# Altium schematic sheet Driver Display - Voltage Regulator.SchDoc
size Letter; Organization: Midnight Sun Solar Rayce Car Team; Address1: University of Waterloo; Address2: 200 University Ave W; Address3: Waterloo, ON, Canada; Address4: N2L 3E9; Website: www.uwmidsun.com
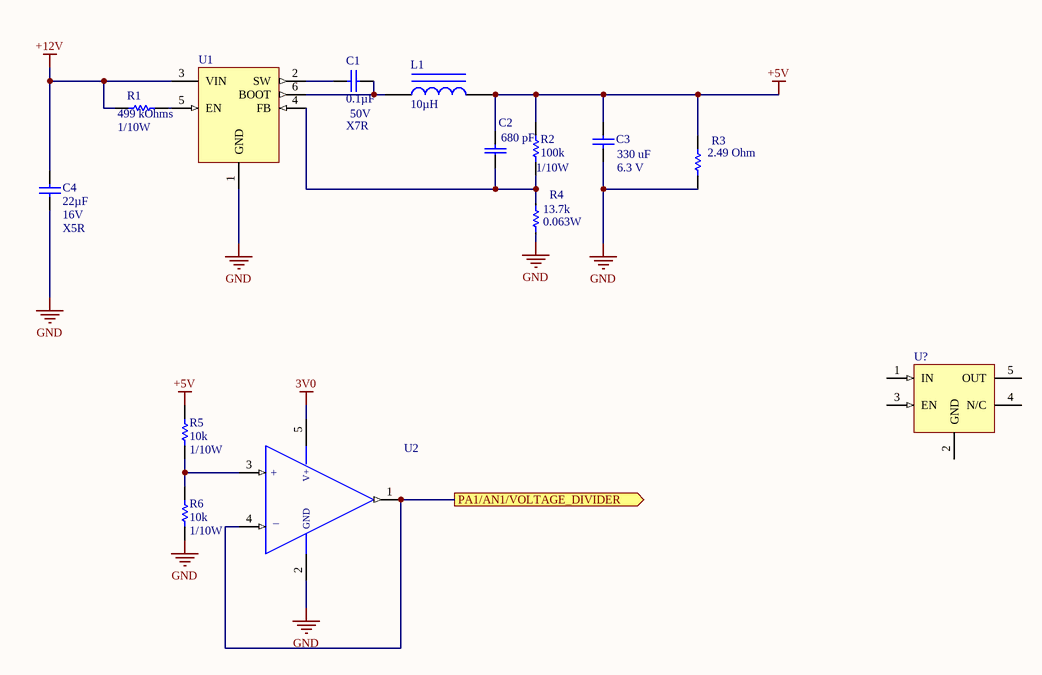
[diagram p0: Driver Display - Voltage Regulator.SchDoc]

## Parts
C1  Capacitance: 0.1µF  Voltage: 50V  Temperature Coefficient: X7R  [CAP, 0603]  (hidden comment: CAP CER 0.1UF 50V 10% X7R 0603)
C2  CAP CER 680PF 25V C0G 0201  [CAP, 0603]  (value not drawn)
C3  CAP CER 330UF 6.3V X5R 1210  (value not drawn)
C4  Capacitance: 22µF  Voltage: 16V  Temperature Coefficient: X5R  [CAP, 1210]  (hidden comment: CAP CER 22UF 16V ±20% X5R 1210)
L1  Inductance: 10µH  [1210]  (hidden comment: IND 10uH 0.9A 20% 1210)
R1  RES 499K OHM 1% 1/10W 0603  [RES, 0603]  (value not drawn)
R2  Resistance: 100k  Power: 1/10W  [RES, 0603]  (hidden comment: RES 100K OHM 5% 1/8W 0603_1)
R3  RES 2.49 OHM 1% 1/10W 0603  [RES, 0603]  (value not drawn)
R4  RES 13.7K OHM 1% 1/10W 0603  [RES, 0603]  (value not drawn)
R5  Resistance: 10k  Power: 1/10W  [RES, 0603]  (hidden comment: RES 10K OHM 1% 1/10W 0603)
R6  Resistance: 10k  Power: 1/10W  [RES, 0603]  (hidden comment: RES 10K OHM 1% 1/10W 0603)
U1  IC REG BUCK ADJ 2A SYNC 6SOT  [SOT23-6]  (value not drawn)
U2  IC OP AMP GEN PURPOSE RR 10MHZ SOT-23-5  [IC OP AMP GP RR 10MHZ SOT-23-5]  (value not drawn)
U?  IC REG LDO 3V 250MA SOT23-5  [SOT95P280X145-5N]  (value not drawn)

## Ports
PA1/AN1/VOLTAGE_DIVIDER (out)

## Nets
3V0: U2.5(VDD)
+5V: C2.1 C3.1 L1.2 R2.1 R3.1 R5.1
+12V: C4.1 R1.1 U1.3(VIN)
GND: C3.2 C4.2 R3.2 R4.?2 R6.2 U1.1(GND) U2.2(VSS)
PA1/AN1/VOLTAGE_DIVIDER: U2.1(OUTPUT) U2.4(-IN) ; port PA1/AN1/VOLTAGE_DIVIDER
NetC1_1: C1.1 U1.2(SW)
NetC1_2: C1.2 L1.1 U1.6(BOOT)
NetC2_2: C2.2 R2.2 R4.?1 U1.4(FB)
NetR1_2: R1.2 U1.5(EN)
NetR5_2: R5.2 R6.1 U2.3(+IN)

Not connected (* = marked no-connect by the designer): U? 1(IN) 2(GND) 3(EN) 4(N/C) 5(OUT)

## Notes on the sheet
- (near R1) 499 kOhms
- (near R1) 1/10W
- (near C3) 330 uF
- (near C3) 6.3 V
- Project:
- Title:
- Size:
- Project Lead:
- Letter
- Revision:
- University of Waterloo
- 200 University Ave W
- Waterloo, ON, Canada
- N2L 3E9
- Date:
- Sheet
- of
- Website:
- (in symbol CAP CER 680PF 25V C0G 0201) 680 pF
- (in symbol IC OP AMP GEN PURPOSE RR 10MHZ SOT-23-5) V+; +; GND; _
- (in symbol RES 2.49 OHM 1% 1/10W 0603) 2.49 Ohm
- (in symbol RES 13.7K OHM 1% 1/10W 0603) 13.7k; 0.063W

## Library data of the parts
C1 = CAP CER 0.1UF 50V 10% X7R 0603: 0.10µF ±10% 50V Ceramic Capacitor X7R 0603 (1608 Metric); Manufacturer 1: AVX Corporation; Manufacturer Part Number 1: 06035C104KAT2A; Supplier 1: Digi-Key; Supplier Part Number 1: 478-5052-1-ND; Packaging: Cut Tape (CT); Part Status: Active; Operating Temperature: -55°C ~ 125°C; Ratings: -; Mounting Type: Surface Mount, MLCC; Package / Case: 0603 (1608 Metric); Size / Dimension: 0.063" L x 0.032" W (1.60mm x 0.81mm); Height - Seated (Max): -; Thickness (Max): 0.035" (0.90mm); Lead Spacing: -; Lead Style: -; ComponentLink1URL: http://datasheets.avx.com/X7RDielectric.pdf; ComponentLink1Description: http://datasheets.avx.com/X7RDielectric.pdf; Tolerance: ±10%
C2 = CAP CER 680PF 25V C0G 0201: 680pF ±5% 25V Ceramic Capacitor C0G, NP0 0201 (0603 Metric); Manufacturer: Murata; Manufacturer Part Number: GRM0335C1E681JA01D; Supplier 1: Digi-Key; Stock 1: 66100; Pricing 1: 1=0.1, 10=0.017, 100=0.0078, 500=0.0056, 1000=0.0044, 2500=0.004, 5000=0.0037 (USD); Voltage Rating (DC): 25V; Dielectric: C0G; Tolerance: 5%; Capacitance: 680pF; Length: 600um; Width: 300um; Thickness: 300um; Supplier Part Number 1: 490-14330-1-ND
C3 = CAP CER 330UF 6.3V X5R 1210: 330µF ±20% 6.3V Ceramic Capacitor X5R 1210 (3225 Metric); Manufacturer: Taiyo Yuden; Manufacturer Part Number: JMK325ABJ337MM-P; Supplier 1: Digi-Key; Stock 1: 1427; Pricing 1: 1=5.57, 10=4.492, 100=3.5039, 500=2.6055 (USD); Supplier Part Number 1: 587-5449-1-ND
C4 = CAP CER 22UF 16V ±20% X5R 1210: 22µF ±20% 16V Ceramic Capacitor X5R 1210 (3225 Metric); Manufacturer 1: Murata Electronics North America; Manufacturer Part Number 1: GRM32ER61C226ME20L; Supplier 1: Digi-Key; Supplier Part Number 1: 490-1881-1-ND; Packaging: Cut Tape (CT); Part Status: Active; Operating Temperature: -55°C ~ 85°C; Ratings: -; Mounting Type: Surface Mount, MLCC; Package / Case: 1210 (3225 Metric); Size / Dimension: 0.126" L x 0.098" W (3.20mm x 2.50mm); Height - Seated (Max): -; Thickness (Max): 0.106" (2.70mm); Lead Spacing: -; Lead Style: -; ComponentLink1URL: http://www.murata.com/~/media/webrenewal/support/library/catalog/products/capacitor/mlcc/c02e.ashx; ComponentLink1Description: http://www.murata.com/~/media/webrenewal/support/library/catalog/products/capacitor/mlcc/c02e.ashx; Tolerance: ±20%
L1 = IND 10uH 0.9A 20% 1210: 10µH Shielded Wirewound Inductor 900mA 420 mOhm Max 1210 (3225 Metric); Manufacturer: Murata Electronics North America; Manufacturer Part Number: 1277AS-H-100M=P2; Current - Saturation: 1.25A; Supplier 1: Digi-Key; Supplier Part Number 1: 490-10589-1-ND; Type: Wirewound; Tolerance: ±20%; Current Rating: 0.9A; Shielding: Shielded; DC Resistance (DCR): 420 mOhm Max; Height - Seated (Max): 0.047" (1.20mm); ComponentLink1URL: http://www.toko.co.jp/products-murata/pdf/inductors/m_dfe322512c.pdf; ComponentLink1Description: datasheet
R1 = RES 499K OHM 1% 1/10W 0603: 499 kOhms ±1% 0.1W, 1/10W Chip Resistor 0603 (1608 Metric) Automotive AEC-Q200 Thick Film; Manufacturer: Stackpole Electronics; Manufacturer Part Number: RMCF0603FT499K; Resistance: 499kR; Power Rating: 100mW; Temperature Coefficient: 100ppm/°C; Supplier 1: Digi-Key; Stock 1: 5000; Mount: Surface Mount; Case/Package: 0603; Case Code (Metric): 1608; Case Code (Imperial): 0603; Contact Plating: Tin,Matte; Min Operating Temperature: -55°C; Max Operating Temperature: 155°C; Tolerance: 1%; Packaging: Tape and Reel; Composition: Thick Film; Number of Terminations: 2; Max Power Dissipation: 100mW; Length: 0.061inch; Height: 0.022inch; Width: 0.031inch; Radiation Hardening: No; Lead Free: Lead Free; ComponentLink1URL: https://www.seielect.com/Catalog/SEI-RMCF_RMCP.pdf; ComponentLink1Description: https://www.seielect.com/Catalog/SEI-RMCF_RMCP.pdf; ComponentLink2URL: http://components.arrow.com/part/dataview/40961429S7516275N1174; ComponentLink2Description: http://components.arrow.com/part/dataview/40961429S7516275N1174; ComponentLink3URL: http://www.seielect.com/Catalog/SEI-RMCF_RMCP.pdf; ComponentLink3Description: http://www.seielect.com/Catalog/SEI-RMCF_RMCP.pdf; Supplier Part Number 1: RMCF0603FT499K-ND
R2 = RES 100K OHM 5% 1/8W 0603_1: RES SMD 100K OHM 5% 1/10W 0603; Manufacturer 1: Yageo; Manufacturer Part Number 1: RC0603JR-07100KL; Temperature Coefficient: ±100ppm/°C; Supplier 1: Digi-Key; Supplier Part Number 1: 311-100KGRCT-ND; Packaging: Cut Tape (CT); Part Status: Active; Composition: Thick Film; Operating Temperature: -55°C ~ 155°C; Package / Case: 0603 (1608 Metric); Supplier Device Package: 0603; Size / Dimension: 0.063" L x 0.031" W (1.60mm x 0.80mm); Height - Seated (Max): 0.022" (0.55mm); Failure Rate: -; ComponentLink1URL: http://www.yageo.com/documents/recent/PYu-RC_Group_51_RoHS_L_7.pdf; ComponentLink1Description: http://www.yageo.com/documents/recent/PYu-RC_Group_51_RoHS_L_7.pdf; Tolerance: ±5%
R3 = RES 2.49 OHM 1% 1/10W 0603: 2.49 Ohms ±1% 0.1W, 1/10W Chip Resistor 0603 (1608 Metric) Moisture Resistant Thick Film; Manufacturer: Yageo; Manufacturer Part Number: RC0603FR-072R49L; Resistance: 2.49R; Temperature Coefficient: 200ppm/°C; Power Rating: 100mW; Voltage Rating: 50V; Working Voltage: 75V; Supplier 1: Digi-Key; Stock 1: 24600; Pricing 1: 1=0.1, 10=0.022, 100=0.0089, 1000=0.004, 2500=0.0035 (USD); Case/Package: 0603; Case Code (Metric): 1608; Case Code (Imperial): 0603; Contact Plating: Tin,Matte; Min Operating Temperature: -55°C; Max Operating Temperature: 155°C; Tolerance: 1%; Package Quantity: 1; Packaging: Tape and Reel; Composition: Thick Film; Number of Terminations: 2; Max Power Dissipation: 100mW; Termination: SMD/SMT; Voltage Rating (DC): 50V; Length: 0.063inch; Height: 0.022inch; Width: 0.031inch; Radiation Hardening: No; Lead Free: Lead Free; ComponentLink1URL: https://datasheet.ciiva.com/2456/pyu-r-int-thick-7-2456963.pdf; ComponentLink1Description: https://datasheet.ciiva.com/2456/pyu-r-int-thick-7-2456963.pdf; ComponentLink2URL: https://datasheet.ciiva.com/2456/pyu-r-int-thick-7-2456964.pdf; ComponentLink2Description: https://datasheet.ciiva.com/2456/pyu-r-int-thick-7-2456964.pdf; ComponentLink3URL: https://datasheet.ciiva.com/2456/pyu-r-int-thick-7-2456965.pdf; ComponentLink3Description: https://datasheet.ciiva.com/2456/pyu-r-int-thick-7-2456965.pdf; ComponentLink4URL: https://datasheet.ciiva.com/12575/rc0603-272842-12575883.pdf; ComponentLink4Description: https://datasheet.ciiva.com/12575/rc0603-272842-12575883.pdf; Supplier Part Number 1: 311-2.49HRCT-ND
R4 = RES 13.7K OHM 1% 1/10W 0603: 13.7 kOhms ±1% 0.1W, 1/10W Chip Resistor 0603 (1608 Metric) Automotive AEC-Q200 Thick Film; Supplier 1: Digi-Key
R5 R6 = RES 10K OHM 1% 1/10W 0603: RES SMD 10K OHM 1% 1/10W 0603; Manufacturer 1: Yageo; Manufacturer Part Number 1: RC0603FR-0710KL; Temperature Coefficient: ±100ppm/°C; Supplier 1: Digi-Key; Supplier Part Number 1: 311-10.0KHRCT-ND; Packaging: Cut Tape (CT); Part Status: Active; Composition: Thick Film; Operating Temperature: -55°C ~ 155°C; Package / Case: 0603 (1608 Metric); Supplier Device Package: 0603; Size / Dimension: 0.063" L x 0.031" W (1.60mm x 0.80mm); Height - Seated (Max): 0.022" (0.55mm); Failure Rate: -; ComponentLink1URL: http://www.yageo.com/documents/recent/PYu-RC_Group_51_RoHS_L_7.pdf; ComponentLink1Description: http://www.yageo.com/documents/recent/PYu-RC_Group_51_RoHS_L_7.pdf; Tolerance: ±1%
U1 = IC REG BUCK ADJ 2A SYNC 6SOT: Buck Switching Regulator IC Positive Adjustable 0.596V 1 Output 2A SOT-23-6 Thin, TSOT-23-6; Manufacturer: Texas Instruments; Manufacturer Part Number: TPS54202HDDCT; Min Input Voltage: 4.5V; Max Input Voltage: 28V; Number of Outputs: 1; Min Output Voltage: 600mV; Max Output Voltage: 26V; Switching Frequency: 500kHz; Quiescent Current: 40uA; Supplier 1: Digi-Key; Stock 1: 2574; Pricing 1: 1=2, 10=1.796, 100=1.4436 (USD); Case/Package: SOT-6; Number of Pins: 6; Min Operating Temperature: -40°C; Max Operating Temperature: 125°C; Output Current: 2A; Packaging: Cut Tape; Output Voltage: 26V; REACH SVHC: No SVHC; Lead Free: Lead Free; ComponentLink1URL: http://www.ti.com/lit/ds/symlink/tps54202h.pdf; ComponentLink1Description: http://www.ti.com/lit/ds/symlink/tps54202h.pdf; ComponentLink2URL: http://www.ti.com/general/docs/lit/getliterature.tsp?genericPartNumber=TPS54202H&amp;&amp;fileType=pdf; ComponentLink2Description: http://www.ti.com/general/docs/lit/getliterature.tsp?genericPartNumber=TPS54202H&amp;&amp;fileType=pdf; ComponentLink3URL: http://www.ti.com/general/docs/lit/getliterature.tsp?genericPartNumber=TPS54202H&&fileType=pdf; ComponentLink3Description: http://www.ti.com/general/docs/lit/getliterature.tsp?genericPartNumber=TPS54202H&&fileType=pdf; Supplier Part Number 1: 296-44497-1-ND
U2 = IC OP AMP GEN PURPOSE RR 10MHZ SOT-23-5: General Purpose Amplifier 1 Circuit Rail-to-Rail SOT-23-5; Manufacturer 1: Texas Instruments; Manufacturer Part Number 1: TLV316QDBVRQ1; Description 1: IC OP AMP GP RR 10MHZ 5-SOT-23; Number of Circuits: 1; Slew Rate: 6 V/µs; Current - Supply: 400µA; Current - Output / Channel: 50mA; Voltage - Supply, Single/Dual (±): 1.8 V ~ 5.5 V, ±0.9 V ~ 2.75 V; Supplier 1: Digi-Key; Supplier Part Number 1: 296-45323-1-ND; RoHS: RoHS Compliant; Category: Integrated Circuits (ICs); Stock 1: 1747; Pricing 1: 1=1.33, 10=1.185, 100=0.9234, 500=0.76276, 1000=0.60218 (CAD); Packaging: Cut Tape (CT); Part Status: Active; Amplifier Type: General Purpose; Output Type: Rail-to-Rail; -3db Bandwidth: -; Operating Temperature: -40°C ~ 125°C; Mounting Type: Surface Mount; Package / Case: SC-74A, SOT-753; Supplier Device Package: SOT-23-5; ComponentLink1URL: http://www.ti.com/lit/ds/symlink/tlv316-q1.pdf; ComponentLink1Description: http://www.ti.com/lit/ds/symlink/tlv316-q1.pdf
U? = IC REG LDO 3V 250MA SOT23-5: Linear Voltage Regulator IC Positive Fixed 1 Output 3V 250mA SOT-23-5; Manufacturer: Texas Instruments; Manufacturer Part Number: LP5907QMFX-3.0Q1; Number of Outputs: 1; Min Input Voltage: 2.2V; Max Input Voltage: 5.5V; Dropout Voltage: 50mV; Quiescent Current: 425uA; Accuracy: 2%; Supplier 1: Digi-Key; Stock 1: 160397; Pricing 1: 1=0.65, 10=0.56, 100=0.4182, 500=0.3286, 1000=0.2539 (USD); Mount: Surface Mount; Min Operating Temperature: -40°C; Max Operating Temperature: 125°C; Max Output Current: 250mA; Output Voltage: 3V; Packaging: Tape and Reel; Output Current: 250mA; Number of Regulators: 1; Polarity: Positive; Radiation Hardening: No; Lead Free: Lead Free; ComponentLink1URL: https://datasheet.ciiva.com/48677/lp5907-q1-48677562.pdf; ComponentLink1Description: https://datasheet.ciiva.com/48677/lp5907-q1-48677562.pdf; Supplier Part Number 1: 296-40364-1-ND